# Altium schematic sheet MaixCAMPort.SchDoc
size A4; SheetNumber: 1; SheetTotal: 4
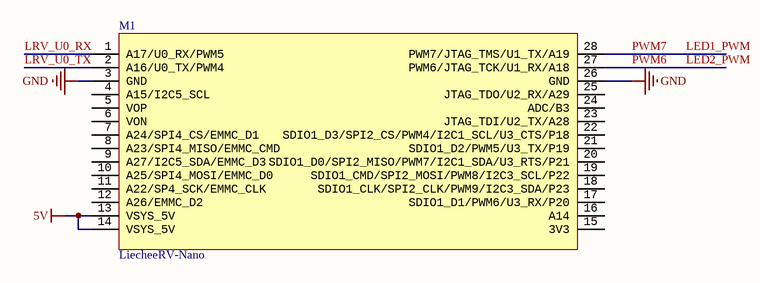
[diagram p0: MaixCAMPort.SchDoc]

## Parts
M1  LiecheeRV-Nano  [LicheeRV-Nano(SDIO_NC)-半孔探针]

## Nets
5V: M1.13(VSYS_5V) M1.14(VSYS_5V)
GND: M1.3(GND) M1.26(GND)
LED1_PWM: M1.28(PWM7/JTAG_TMS/U1_TX/A19)  [also labelled PWM7]
LED2_PWM: M1.27(PWM6/JTAG_TCK/U1_RX/A18)  [also labelled PWM6]
LRV_U0_RX: M1.1(A17/U0_RX/PWM5)
LRV_U0_TX: M1.2(A16/U0_TX/PWM4)

Not connected (* = marked no-connect by the designer): M1 4(A15/I2C5_SCL) 5(VOP) 6(VON) 7(A24/SPI4_CS/EMMC_D1) 8(A23/SPI4_MISO/EMMC_CMD) 9(A27/I2C5_SDA/EMMC_D3) 10(A25/SPI4_MOSI/EMMC_D0) 11(A22/SP4_SCK/EMMC_CLK) 12(A26/EMMC_D2) 15(3V3) 16(A14) 17(SDIO1_D1/PWM6/U3_RX/P20) 18(SDIO1_CLK/SPI2_CLK/PWM9/I2C3_SDA/P23) 19(SDIO1_CMD/SPI2_MOSI/PWM8/I2C3_SCL/P22) 20(SDIO1_D0/SPI2_MISO/PWM7/I2C1_SDA/U3_RTS/P21) 21(SDIO1_D2/PWM5/U3_TX/P19) 22(SDIO1_D3/SPI2_CS/PWM4/I2C1_SCL/U3_CTS/P18) 23(JTAG_TDI/U2_TX/A28) 24(ADC/B3) 25(JTAG_TDO/U2_RX/A29)

## Library data of the parts
M1 = LiecheeRV-Nano: Sipeed MaixCAM模块